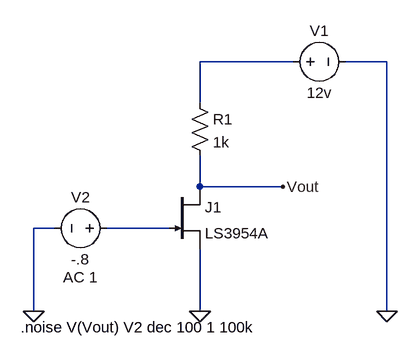
[diagram p0: schematic Draft1.asc]
Draft1.asc, the LTspice schematic file:
Version 4
SHEET 1 880 680
WIRE 336 -96 192 -96
WIRE 480 -96 416 -96
WIRE 192 -32 192 -96
WIRE 192 96 192 48
WIRE 320 96 192 96
WIRE -32 160 -64 160
WIRE 144 160 48 160
WIRE -64 288 -64 160
WIRE 192 288 192 192
WIRE 480 288 480 -96
FLAG -64 288 0
FLAG 192 288 0
FLAG 480 288 0
FLAG 320 96 Vout
SYMBOL njf 144 96 R0
SYMATTR InstName J1
SYMATTR Value LS3954A
SYMBOL res 176 -48 R0
SYMATTR InstName R1
SYMATTR Value 1k
SYMBOL voltage 320 -96 R270
WINDOW 0 32 56 VTop 2
WINDOW 3 -32 56 VBottom 2
WINDOW 123 0 0 Left 0
WINDOW 39 0 0 Left 0
SYMATTR InstName V1
SYMATTR Value 12v
SYMBOL voltage 64 160 R90
WINDOW 0 -32 56 VBottom 2
WINDOW 3 32 56 VTop 2
WINDOW 123 60 56 VTop 2
WINDOW 39 0 0 Left 0
SYMATTR InstName V2
SYMATTR Value -.8
SYMATTR Value2 AC 1
TEXT -84 312 Left 2 !.noise V(Vout) V2 dec 100 1 100k

The netlist it stands for:
* Draft1.asc
J1 Vout N002 0 LS3954A
R1 N001 Vout 1k
V1 N001 0 12v
V2 N002 0 -.8 AC 1
.model NJF NJF
.model PJF PJF
.lib standard.jft
.noise V(Vout) V2 dec 100 1 100k
.backanno
.end